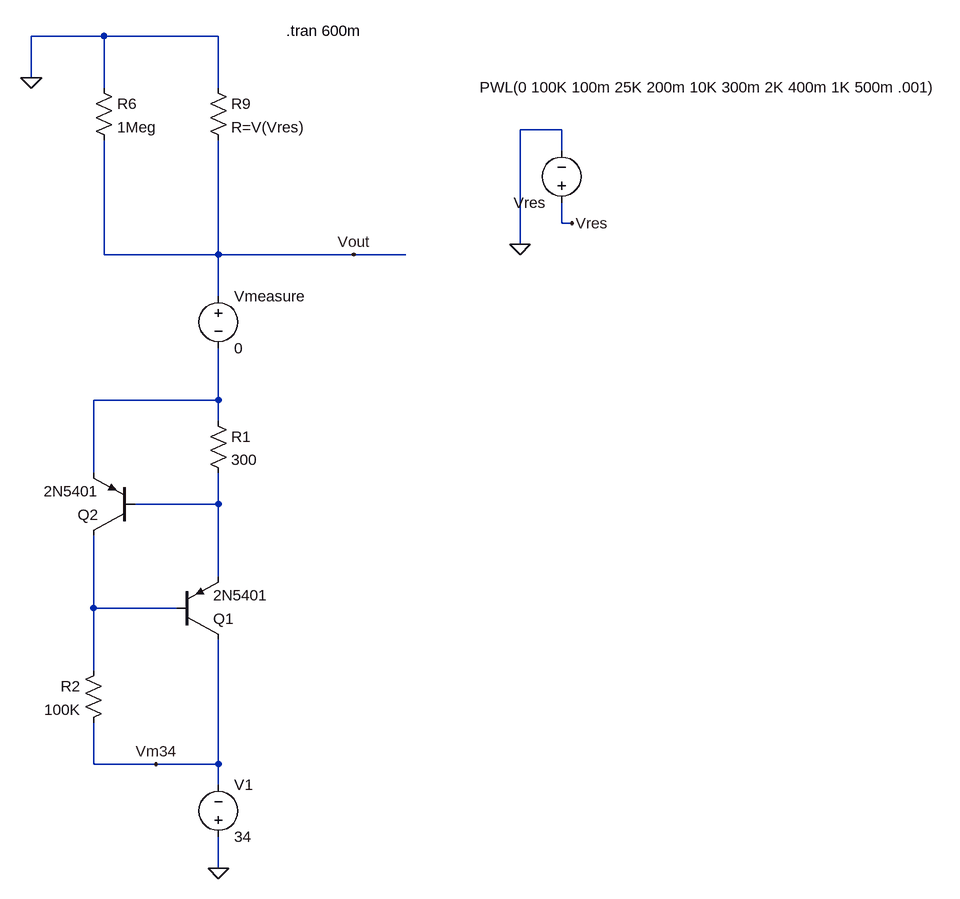
[diagram p0: schematic Simple Current Limit for Negarive supply_ams.asc]
Simple Current Limit for Negarive supply_ams.asc, the LTspice schematic file:
Version 4
SHEET 1 1492 772
WIRE -32 -528 -144 -528
WIRE 144 -528 -32 -528
WIRE -144 -464 -144 -528
WIRE -32 -448 -32 -528
WIRE 144 -448 144 -528
WIRE 672 -384 608 -384
WIRE 672 -352 672 -384
WIRE 672 -240 672 -272
WIRE 688 -240 672 -240
WIRE 608 -208 608 -384
WIRE -32 -192 -32 -368
WIRE 144 -192 144 -368
WIRE 144 -192 -32 -192
WIRE 352 -192 144 -192
WIRE 432 -192 352 -192
WIRE 144 -128 144 -192
WIRE 144 32 144 -48
WIRE 144 32 -48 32
WIRE 144 64 144 32
WIRE -48 144 -48 32
WIRE 144 192 144 144
WIRE 144 192 16 192
WIRE 144 304 144 192
WIRE -48 352 -48 240
WIRE 80 352 -48 352
WIRE -48 448 -48 352
WIRE -48 592 -48 528
WIRE 48 592 -48 592
WIRE 144 592 144 400
WIRE 144 592 48 592
WIRE 144 624 144 592
WIRE 144 752 144 704
FLAG 144 752 0
FLAG 48 592 Vm34
FLAG 352 -192 Vout
FLAG 608 -208 0
FLAG 688 -240 Vres
FLAG -144 -464 0
SYMBOL res 128 48 R0
SYMATTR InstName R1
SYMATTR Value 300
SYMBOL res -32 432 M0
SYMATTR InstName R2
SYMATTR Value 100K
SYMBOL voltage 144 720 M180
WINDOW 0 24 96 Left 2
WINDOW 3 24 16 Left 2
SYMATTR InstName V1
SYMATTR Value 34
SYMBOL pnp 80 400 M180
SYMATTR InstName Q1
SYMATTR Value 2N5401
SYMBOL pnp 16 240 R180
SYMATTR InstName Q2
SYMATTR Value 2N5401
SYMBOL res -48 -464 R0
SYMATTR InstName R6
SYMATTR Value 1Meg
SYMBOL voltage 144 -144 R0
WINDOW 123 0 0 Left 2
WINDOW 39 0 0 Left 2
SYMATTR InstName Vmeasure
SYMATTR Value 0
SYMBOL voltage 672 -256 R180
WINDOW 3 -581 193 Left 2
WINDOW 123 0 0 Left 2
WINDOW 39 0 0 Left 2
SYMATTR InstName Vres
SYMATTR Value PWL(0 100K 100m 25K 200m 10K 300m 2K 400m 1K 500m .001)
SYMBOL res 128 -464 R0
SYMATTR InstName R9
SYMATTR Value R=V(Vres)
TEXT 248 -536 Left 2 !.tran 600m

The netlist it stands for:
* Simple Current Limit for Negarive supply_ams.asc
R1 N001 N002 300
R2 N003 Vm34 100K
V1 0 Vm34 34
Q1 Vm34 N003 N002 0 2N5401
Q2 N003 N002 N001 0 2N5401
R6 0 Vout 1Meg
Vmeasure Vout N001 0
Vres Vres 0 PWL(0 100K 100m 25K 200m 10K 300m 2K 400m 1K 500m .001)
R9 0 Vout R=V(Vres)
.model NPN NPN
.model PNP PNP
.lib standard.bjt
.tran 600m
.backanno
.end